# Altium schematic sheet Frontend.SchDoc
size A2
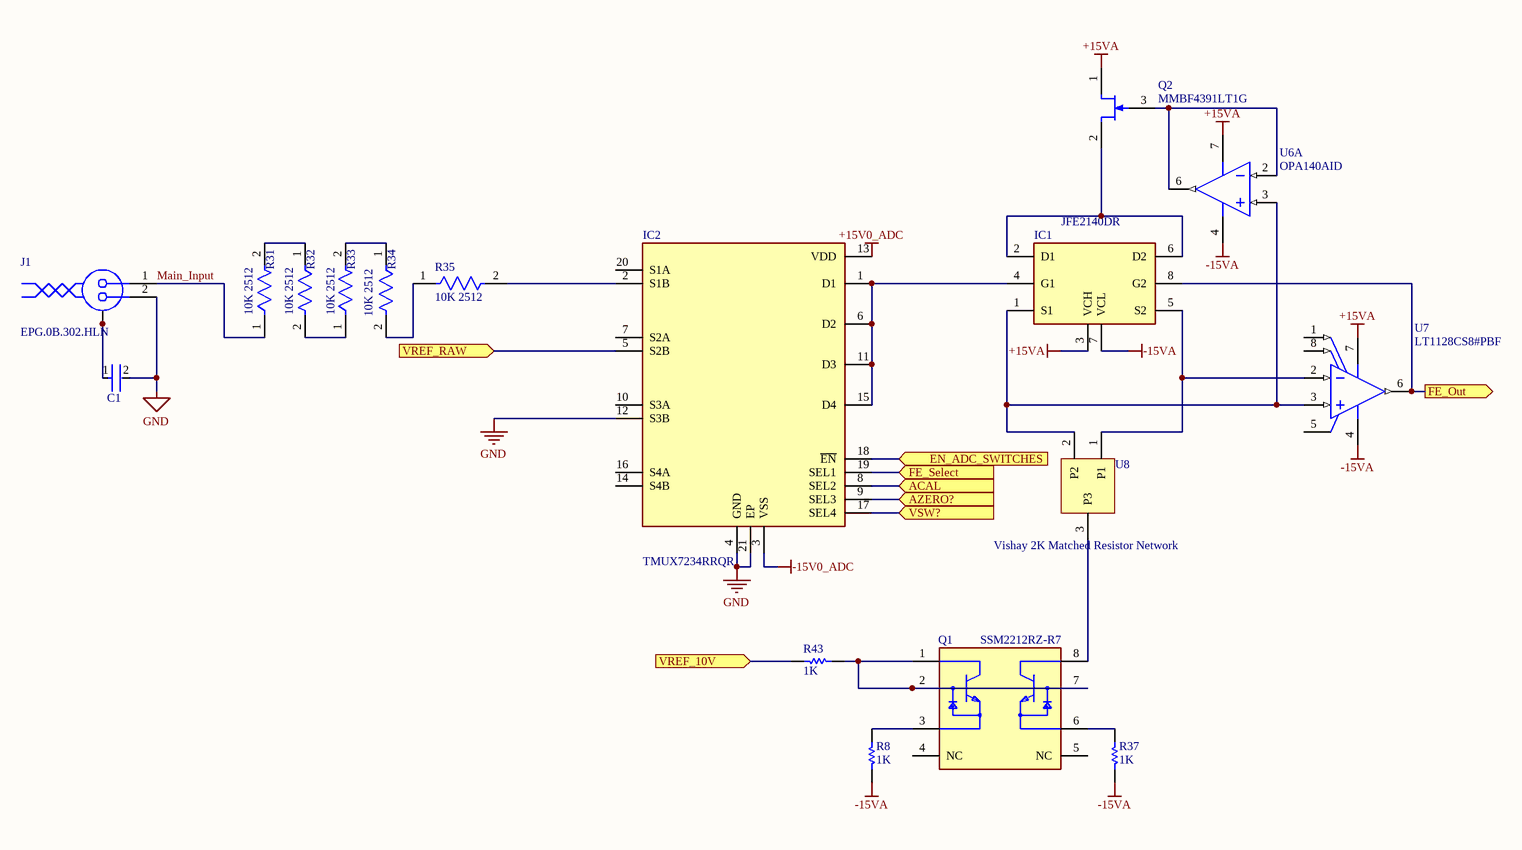
[diagram p0: Frontend.SchDoc]

## Parts
C1  CGA3E2X7R1H104K080AA  [FP-CGA3E-0_3-0_1-IPC_A]  (value not drawn)
IC1  JFE2140DR  [SOIC127P600X175-8N]
IC2  TMUX7234RRQR  [QFN50P400X400X80-21N-D]
J1  EPG.0B.302.HLN  [EPG.0B.302.HLN]
Q1  SSM2212RZ-R7  [FP-R-8-IPC_C]
Q2  MMBF4391LT1G  [ONSC-SOT-23-3-318-08_V]
R8  1K  [RESC2013X60X35ML10T20]
R31  10K 2512  [FP-CRCW2512-e3-MFG]
R32  10K 2512  [FP-CRCW2512-e3-MFG]
R33  10K 2512  [FP-CRCW2512-e3-MFG]
R34  10K 2512  [FP-CRCW2512-e3-MFG]
R35  10K 2512  [FP-CRCW2512-e3-MFG]
R37  1K  [RESC2013X60X35ML10T20]
R43  1K  [RESC2013X60X35ML10T20]
U6  OPA140AID  [D0008A_M]  (part A of 2)
U7  LT1128CS8#PBF  [LT-S8-8_M]
U8  Vishay 2K Matched Resistor Network  [MAXM-U3+2_L]

## Ports
ACAL (in), AZERO? (in), EN_ADC_SWITCHES (in), FE_Out (out), FE_Select (in), VREF_10V (in), VREF_RAW (in), VSW? (in)

## Nets
+15V0_ADC: IC2.13(VDD)
+15VA: IC1.3(VCH) Q2.1(D) U6.7(V+) U7.7(V+)
-15V0_ADC: IC2.3(VSS)
-15VA: IC1.7(VCL) R8.1 R37.1 U6.4(V-) U7.4(V-)
GND: C1.2 IC2.4(GND) IC2.12(S3B) IC2.21(EP) J1.2
ACAL: IC2.8(SEL2) ; port ACAL
AZERO?: IC2.9(SEL3) ; port AZERO?
EN_ADC_SWITCHES: IC2.18(~{EN}) ; port EN_ADC_SWITCHES
FE_Out: IC1.8(G2) U7.6(OUT) ; port FE_Out
FE_Select: IC2.19(SEL1) ; port FE_Select
Main_Input: J1.1 R31.1
VREF_10V: R43.1 ; port VREF_10V
VREF_RAW: IC2.5(S2B) ; port VREF_RAW
VSW?: IC2.17(SEL4) ; port VSW?
NetC1_1: C1.1 J1.4 J1.5 J1.6 J1.7
NetIC1_1: IC1.1(S1) U6.3(IN+) U7.3(+IN) U8.2(P2)
NetIC1_2: IC1.2(D1) IC1.6(D2) Q2.2(S)
NetIC1_4: IC1.4(G1) IC2.1(D1) IC2.6(D2) IC2.11(D3) IC2.15(D4)
NetIC1_5: IC1.5(S2) U7.2(-IN) U8.1(P1)
NetIC2_2: IC2.2(S1B) R35.2
NetQ1_1: Q1.1(C1) Q1.2(B1) Q1.7(B2) R43.2
NetQ1_3: Q1.3(E1) R8.2
NetQ1_6: Q1.6(E2) R37.2
NetQ1_8: Q1.8(C2) U8.3(P3)
NetQ2_3: Q2.3(G) U6.2(IN-) U6.6(OUT)
NetR31_2: R31.2 R32.1
NetR32_2: R32.2 R33.1
NetR33_2: R33.2 R34.1
NetR34_2: R34.2 R35.1

Not connected (* = marked no-connect by the designer): IC2 7(S2A) 10(S3A) 14(S4B) 16(S4A) 20(S1A); Q1 4(NC) 5(NC); U7 1(VOS_TRIM) 5(OVERCOMP) 8(VOS_TRIM)

## Library data of the parts
C1 = CMP-2000-07546-2: Cap Ceramic 100nF 50V X7R 10% Pad SMD 0603 +125°C Automotive T/R; Weight: 7.1E-05oz; Composition: Ceramic; Max Operating Temperature: 125°C; Termination: SMD/SMT; Dielectric: X7R; Length: 1.6mm; Package Quantity: 1; REACH SVHC: No SVHC; Lead Free: Lead Free; Case Code (Metric): 1608; Min Operating Temperature: -55°C; Packaging: Tape and Reel; Tolerance: 10%; Voltage Rating: 50V; Case Code (Imperial): 0603; Capacitance: 100nF; Case/Package: 0603; Voltage Rating (DC): 50V; Depth: 0.8mm; Radiation Hardening: No; Ratings: AEC-Q200; Mount: Surface Mount; Voltage: 50V; Thickness: 0.035inch; Width: 0.8mm; Height: 0.8mm
IC1 = JFE2140DR: Integrated Circuit; Manufacturer_Name: Texas Instruments; Datasheet Link: https://www.ti.com/lit/ds/symlink/jfe2140.pdf?ts=1633964558921; Height: 1.75mm; Manufacturer_Part_Number: JFE2140DR; Mouser Part Number: 595-JFE2140DR; Mouser Price/Stock: https://www.mouser.co.uk/ProductDetail/Texas-Instruments/JFE2140DR?qs=A6eO%252BMLsxmQVeRIGZCabaw%3D%3D
IC2 = TMUX7234RRQR: Integrated Circuit; Manufacturer_Name: Texas Instruments; Datasheet Link: https://www.ti.com/lit/gpn/tmux7234; Height: 0.8mm; Manufacturer_Part_Number: TMUX7234RRQR; Mouser Part Number: 595-TMUX7234RRQR; Mouser Price/Stock: https://www.mouser.co.uk/ProductDetail/Texas-Instruments/TMUX7234RRQR?qs=pBJMDPsKWf2ane92Zx3aRA%3D%3D
J1 = CMP-1505-00295-1: Elbow receptacle for printed circuit (solder or screw fixing), Key (G), 0B series, Multipole Type with 2 Contacts; Manufacturer: LEMO; Contact Diameter: 0.9 mm; Rated Current(A): 6; Number of contacts: 2; AWG: 22; ComponentLink1URL: http://www.lemo.com; ComponentLink1Description: Manufacturer URL; DatasheetVersion: Jun-14; PackageReference: EPG.0B.302.HLN; ComponentLink2URL: http://intra.lemo.ch/catalog/ROW/UK_English/unipole_multipole.pdf; PartNumber: EPG.0B.302.HLN; ComponentLink2Description: Datasheet; PackageDescription: Elbow receptacle for printed circuit (solder or screw fixing), Key(G) for Printed Circuit
Q1 = CMP-09180-000002-1: TRANS 2NPN 40V 0.02A 8SOIC; Transition Frequency: 450MHz; Max Power Dissipation: 500mW; Element Configuration: Dual; Max Collector Current: 20mA; Polarity: NPN; Collector Emitter Breakdown Voltage: 45V; Number of Elements: 2; Collector-emitter Voltage-Max: 800mV; Frequency: 200MHz; Packaging: Tape and Reel; RoHS Compliant: Yes; Lead Free: Contains Lead; Contact Plating: Tin; Collector Emitter Voltage (VCEO): 40V; Max Breakdown Voltage: 40V; Case/Package: SOIC; Series: SSM2212; Radiation Hardening: No; Package Quantity: 1000; Number of Pins: 8; Collector Base Voltage (VCBO): 40V; Mount: Surface Mount; Max Operating Temperature: 85°C; Min Operating Temperature: -40°C
Q2 = CMP-1062-00030-1: JFET Switching Transistor, N-Channel, 3-Pin SOT-23, Pb-Free, Tape and Reel; Manufacturer: On Semiconductor; IDSS Min (uA): 50000; IDSS Max (uA): 150000; Crss Max (pF): 3.5; Ciss Max (pF): 14; V(BR)GSS Min (V): 30; Channel Polarity: N Channel; ComponentLink2URL: http://www.onsemi.com/pub_link/Collateral/MMBF4391LT1-D.PDF; PartNumber: MMBF4391LT1G; ComponentLink1URL: http://www.onsemi.com/; PackageDescription: 3-Pin Small Outline Transistor, Body 2.92 x 1.3 mm, Pitch 0.95 mm; DatasheetVersion: Rev. 10; PackageVersion: Rev. AP, 11/2009; ComponentLink2Description: Datasheet; Packing: Tape and Reel; ComponentLink1Description: Manufacturer URL; PackageReference: SOT-23-3-318-08; RoHS: Pb-Free; ComponentLink3Description: Package Specification; ComponentLink3URL: http://www.onsemi.cn/pub_link/Collateral/318-08.PDF; Mounting Technology: Surface Mount
R8 R37 R43 = CMP-2100-03671-1: Chip Resistor, 1 KOhm, +/- 1%, 125 mW, -55 to 155 degC, 0805 (2012 Metric), RoHS, Tape and Reel; Manufacturer: Yageo; Temperature Coefficient: 100ppm/degreesC; Voltage Rating (DC): 150V; Max Power Dissipation: 125mW; Resistance: 1KOhm; Number of Pins: 2; Number of Terminations: 2; Datasheet URL: http://www.yageo.com/NewPortal/yageodocoutput?fileName=/pdf/R-Chip/PYu-RC_Group_51_RoHS_L_5.pdf; Length: 0.079inch; Package Description: 2-Pin Surface Mounted Device, Body 2 x 1.25 mm; Depth: 1.25mm; Height: 0.024inch; Military Standard: Not; Case/Package: 0805; Package Reference: 0805; RoHSCompliant: true; Lead Free: LeadFree; Packaging: TapeandReel; Package Quantity: 1; Datasheet Version: Rev. 5, 10/2016; Tolerance: 1%; Min Operating Temperature: -55degC; Voltage Rating: 150V; Composition: ThickFilm; Case Code (Imperial): 0805; Power Rating: 125mW; Width: 0.049inch; Case Code (Metric): 2012; Manufacturer URL: http://www.yageo.com/; Max Operating Temperature: 155degC; REACH SVHC: Unknown; Termination: SMD/SMT
R31-R35 = CMP-02407-004199-1: RES Thick Film, 100kΩ, 1%, 1W, 100ppm/°C, 2512; Voltage Rating: 500V; Resistance: 100kR; Case Code (Metric): 6432; Temperature Coefficient: 100ppm/°C; Weight: 0.001429oz; Radiation Hardening: No; Voltage Rating (DC): 500V; Case Code (Imperial): 2512; Length: 6.3mm; Number of Pins: 2; Military Standard: Not; Packaging: Tape and Reel; Contact Plating: Tin; Width: 3.15mm; Lead Free: Lead Free; Package Quantity: 2000; Composition: Thick Film; Termination: SMD/SMT; Number of Terminations: 2; Features: Automotive AEC-Q200; Max Power Dissipation: 1W; Case/Package: 2512; Min Operating Temperature: -55°C; Depth: 3.15mm; Max Operating Temperature: 155°C; Tolerance: 1%; Power Rating: 1W; Height: 0.6mm
U6 = CMP-0271-00131-3: 11 MHz, Single Supply, Low Noise, Precision, Rail-to-Rail Output, JFET Amplifier, 4.5 to 36 V, -40 to 125 degC, 8-pin SOIC (D8), Green (RoHS & no Sb/Br); Manufacturer: Texas Instruments; Vio (25C)(Max)(mV): 0.12; Number of Channels: 1; Packing: TUBE; Rating: Catalog; Offset Drift(Typ)(uV/C): 0.35; Sub Family: High Supply Voltage Amplifier (>=30V), Low Input Bias Current Amp (<=10pA), Low Noise Amp (<=10nV/rtHz), Low Offset Voltage Amplifier (<=500uV), Precision Amplifier; Total Supply Voltage(Min)(+5V is 5, +/-5V is 10): 4.5; Iq per channel(Max)(mA): 2; Total Supply Voltage(Max)(+5V is 5, +/-5V is 10): 36; IIB(Max)(pA): 10; GBW(Typ)(MHz): 11; CMRR(Min)(dB): 126; Slew Rate(Typ)(V/us): 20; PackageDescription: 8-Pin Plastic Small Outline, Body 4.9 x 3.9 mm, Pitch 1.27 mm; PackageReference: D0008A; ComponentLink3Description: Package Specification; ComponentLink3URL: http://www.ti.com/litv/pdf/msoi002j; DatasheetVersion: SBOS498A; Mounting Technology: Surface Mount; ComponentLink2Description: Datasheet; ComponentLink2URL: http://www.ti.com/lit/ds/symlink/opa140.pdf; ComponentLink1Description: Manufacturer URL; ComponentLink1URL: http://www.ti.com/; PackageVersion: 4040047-3/M, 06/2011; Code_JEDEC: MS-012; Eco-Plan: Green (RoHS & no Sb/Br); PartNumber: OPA140AID
U7 = CMP-0359-03002-2: Single Channel, Low Noise High Speed Operational Amplifier, 20 MHz Typical GBW, 6 V/us Typical SR, 8 to 44 V, 8-Pin SOIC (S8-8), Commercial, Pb-Free; Linear Technology Part Number: LT1128; Manufacturer: Linear Technology; Vos (mV) Typical: 0.01; Is (mA) Typical: 7.4; GBW (MHz) Typical: 20; Vs Min (V): 8; Channels (#): 1; SR (V/us) Typical: 6; Vs Max (V): 44; ComponentLink3Description: Package Specification; PartNumber: LT1128CS8#PBF; PackageDescription: 8-Pin Plastic Small Outline, Body 4.9 x 3.9 mm, Pitch 1.27 mm; ComponentLink1URL: http://www.linear.com/; ComponentLink2Description: Datasheet; RevisionNote: URLs updated; RoHS: Pb-Free; ComponentLink2URL: http://cds.linear.com/docs/en/datasheet/1028fb.pdf; PackageReference: LT-S8-8; ComponentLink3URL: http://cds.linear.com/docs/en/packaging/05081610_G_SO8.pdf; ComponentLink1Description: Manufacturer URL; DatasheetVersion: Rev. B; PackageVersion: Rev G; Mounting Technology: Surface Mount; Type: VFB
U8 = CMP-0023-00636-1: 30k 2 kV ESD Precision-Matched Resistor-Divider, -40 to 85 degC, 3-pin SOT (U3+2), Pb-Free, Tape and Reel; PartNumber: MAX5491LC01000+T; ComponentLink1Description: Manufacturer URL; PackageDescription: 3-Pin Small-Outline Transistor Package (U3+2), Body 2.92 x 1.3 mm, Pitch 0.95 mm; DatasheetVersion: Rev. 3; ComponentLink2URL: http://datasheets.maximintegrated.com/en/ds/MAX5491.pdf; Applications: Precision Voltage Divider; Mounting Technology: Surface Mount; Code_JEDEC: TO236; PackageVersion: Rev. J, 06/2012; PackageReference: U3+2; ComponentLink3URL: http://pdfserv.maximintegrated.com/package_dwgs/21-0051.PDF; ComponentLink2Description: Datasheet; ComponentLink3Description: Package Specification; ComponentLink1URL: http://www.maximintegrated.com/